# Altium project epsv2.PrjPCB
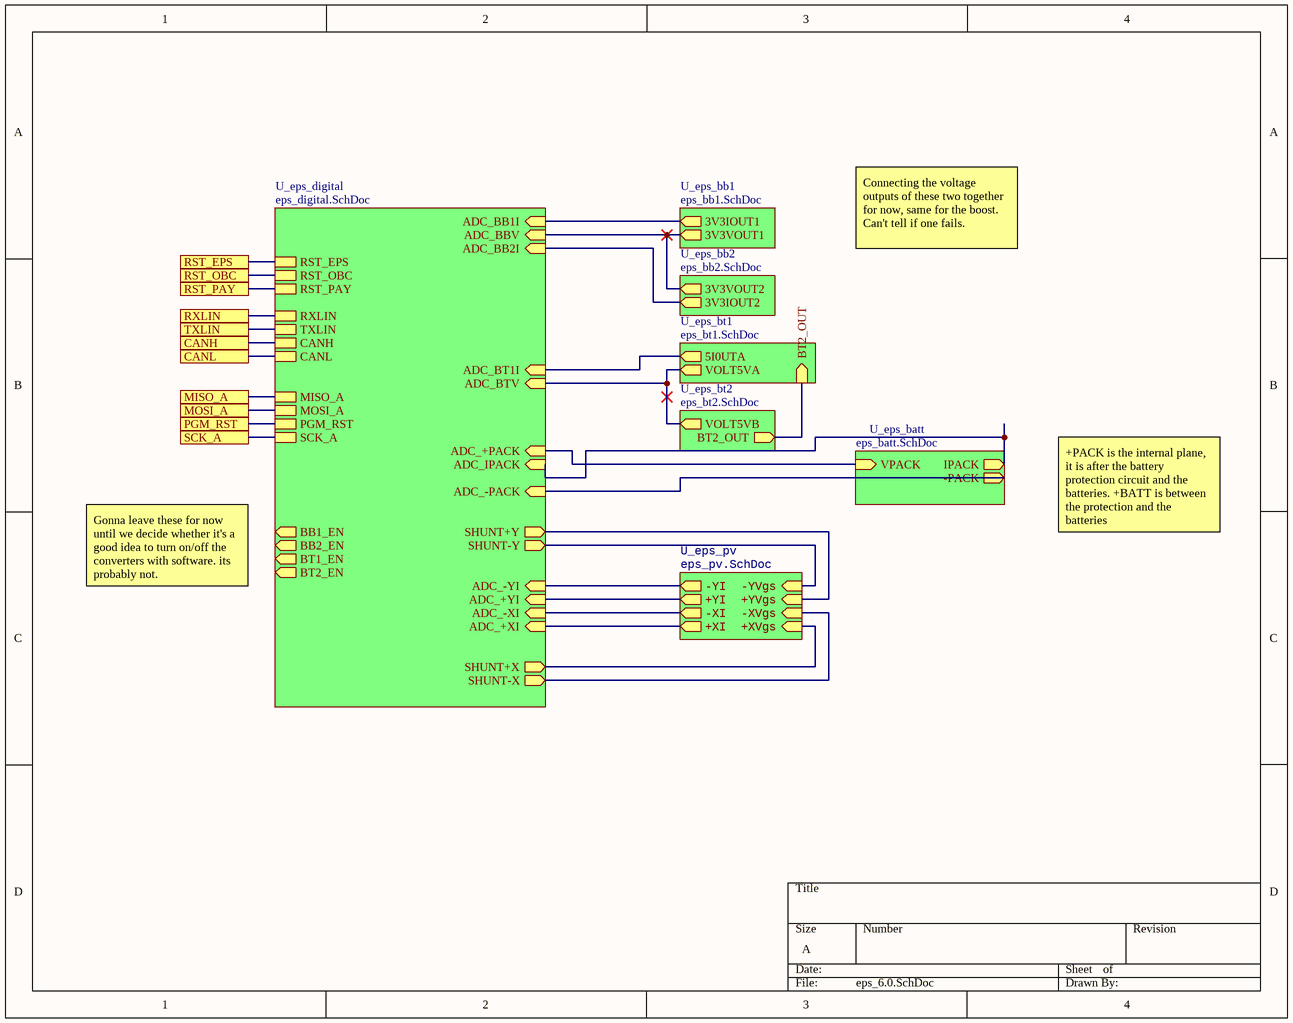
[diagram p0: eps_6.0.SchDoc]
10 sheets, 125 parts. Net scope: hierarchical (ports join the sheet entries above them; power ports are global).
Sheets:
  eps_6.0.SchDoc
    U_eps_digital = eps_digital.SchDoc
      U_eps_32m1 = eps_32m1.SchDoc
      U_eps_can_transceiver = eps_can_transceiver.SchDoc
      U_eps_pex = eps_pex.SchDoc
    U_eps_bb1 = eps_bb1.SchDoc
    U_eps_bb2 = eps_bb2.SchDoc
    U_eps_bt1 = eps_bt1.SchDoc
    U_eps_bt2 = eps_bt2.SchDoc
    U_eps_batt = eps_batt.SchDoc

## Sheet eps_6.0.SchDoc
size A

### Sub-sheets
U_eps_batt = eps_batt.SchDoc: IPACK (out), VPACK (in), -PACK (out)
U_eps_bb1 = eps_bb1.SchDoc: 3V3IOUT1 (out), 3V3VOUT1 (out)
U_eps_bb2 = eps_bb2.SchDoc: 3V3IOUT2 (out), 3V3VOUT2 (out)
U_eps_bt1 = eps_bt1.SchDoc: VOLT5VA (out), 5I0UTA (out), BT2_OUT (in)
U_eps_bt2 = eps_bt2.SchDoc: VOLT5VB (out), BT2_OUT (out)
U_eps_digital = eps_digital.SchDoc: RST_EPS, RST_OBC, RST_PAY, RXLIN, TXLIN, CANH, CANL, MISO_A, MOSI_A, PGM_RST, SCK_A, ADC_BTV (in), BT1_EN (out), BT2_EN (out), ADC_BT1I (in), ADC_-PACK (in), ADC_BB1I (in), ADC_BB2I (in), ADC_+XI (in), ADC_-XI (in), ADC_+YI (in), ADC_+PACK (in), ADC_-YI (in), SHUNT-Y (out), SHUNT+Y (out), BB2_EN (out), BB1_EN (out), ADC_BBV (in), SHUNT-X (out), SHUNT+X (out), ADC_IPACK (in)
U_eps_pv = eps_pv.SchDoc (file not in this document): +YI (out), -YI (out), -YVgs (in), +XI (out), +YVgs (in), +XVgs (in), -XVgs (in), -XI (out)

### Ports
CANH, CANL, MISO_A, MOSI_A, PGM_RST, RST_EPS, RST_OBC, RST_PAY, RXLIN, SCK_A, TXLIN

### Nets
-PACK: sheet U_eps_digital/ADC_-PACK, sheet U_eps_batt/-PACK
MISO_A: port MISO_A, sheet U_eps_digital/MISO_A
MOSI_A: port TXLIN, port MOSI_A, sheet U_eps_digital/TXLIN, sheet U_eps_digital/MOSI_A
RXLIN: port RXLIN, sheet U_eps_digital/RXLIN
Net1_1: sheet U_eps_bt1/BT2_OUT, sheet U_eps_bt2/BT2_OUT
Net5_1: sheet U_eps_digital/ADC_BTV, sheet U_eps_bt1/VOLT5VA, sheet U_eps_bt2/VOLT5VB
Net*5_6: sheet U_eps_digital/ADC_BB1I, sheet U_eps_bb1/3V3IOUT1
Net*6_6: sheet U_eps_digital/ADC_BB2I, sheet U_eps_bb2/3V3IOUT2
Net*30_6: sheet U_eps_digital/ADC_BT1I, sheet U_eps_bt1/5I0UTA
NetC28_2: sheet U_eps_digital/ADC_BBV, sheet U_eps_bb1/3V3VOUT1, sheet U_eps_bb2/3V3VOUT2
NetC45_2: sheet U_eps_digital/ADC_+PACK, sheet U_eps_batt/VPACK
NetP6_3: port SCK_A, sheet U_eps_digital/SCK_A
NetP6_5: port PGM_RST, sheet U_eps_digital/PGM_RST
NetR25_1: port RST_PAY, sheet U_eps_digital/RST_PAY
NetR26_1: port RST_OBC, sheet U_eps_digital/RST_OBC
NetR35_1: port CANL, sheet U_eps_digital/CANL
NetR38_1: port CANH, sheet U_eps_digital/CANH
NetS?_5: port RST_EPS, sheet U_eps_digital/RST_EPS
NetU3_21: sheet U_eps_digital/SHUNT+X, sheet U_eps_pv/+XVgs
NetU3_22: sheet U_eps_digital/SHUNT-X, sheet U_eps_pv/-XVgs
NetU3_23: sheet U_eps_digital/SHUNT+Y, sheet U_eps_pv/+YVgs
NetU3_24: sheet U_eps_digital/SHUNT-Y, sheet U_eps_pv/-YVgs
NetU11_6: sheet U_eps_digital/ADC_IPACK, sheet U_eps_batt/IPACK
(unnamed): sheet U_eps_digital/ADC_+XI, sheet U_eps_pv/+XI
(unnamed): sheet U_eps_digital/ADC_-XI, sheet U_eps_pv/-XI
(unnamed): sheet U_eps_digital/ADC_+YI, sheet U_eps_pv/+YI
(unnamed): sheet U_eps_digital/ADC_-YI, sheet U_eps_pv/-YI

### Notes on the sheet
- Connecting the voltage outputs of these two together for now, same for the boost. Can't tell if one fails.
- +PACK is the internal plane, it is after the battery protection circuit and the batteries. +BATT is between the protection and the batteries
- Gonna leave these for now until we decide whether it's a good idea to turn on/off the converters with software. its probably not.

## Sheet eps_digital.SchDoc
size A4
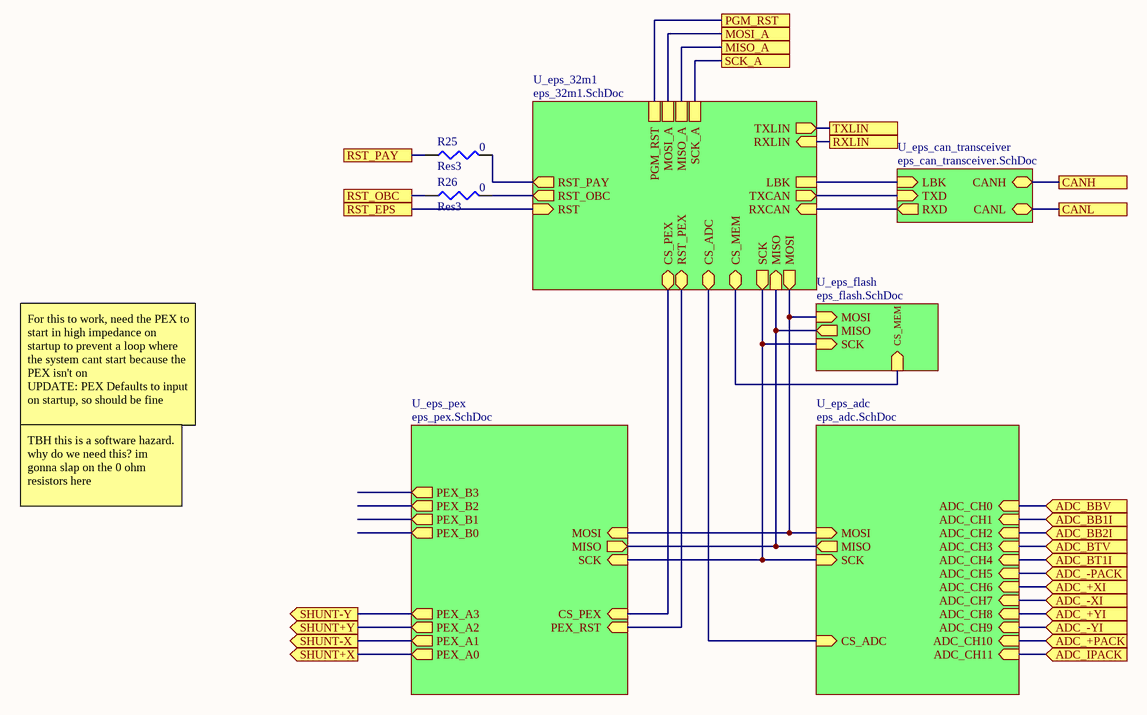
[diagram p1: eps_digital.SchDoc]

### Parts
R25  Res3  value 0  [J1-0603]
R26  Res3  value 0  [J1-0603]

### Sub-sheets
U_eps_32m1 = eps_32m1.SchDoc: MISO (in), SCK (out), TXLIN (out), MOSI (out), TXCAN (out), RXCAN (in), RXLIN (in), RST_OBC (out), RST_PAY (out), RST_PEX (bidir), CS_ADC (bidir), CS_PEX (bidir), CS_MEM (bidir), RST (in), LBK, PGM_RST, MOSI_A, MISO_A, SCK_A
U_eps_adc = eps_adc.SchDoc (file not in this document): ADC_CH10 (in), ADC_CH11 (in), ADC_CH9 (in), ADC_CH5 (in), ADC_CH6 (in), ADC_CH7 (in), ADC_CH3 (in), ADC_CH2 (in), ADC_CH8 (in), ADC_CH4 (in), ADC_CH1 (in), ADC_CH0 (in), MISO (out), MOSI (in), CS_ADC (in), SCK (in)
U_eps_can_transceiver = eps_can_transceiver.SchDoc: RXD (out), TXD (in), LBK (in), CANL (bidir), CANH (bidir)
U_eps_flash = eps_flash.SchDoc (file not in this document): SCK (in), CS_MEM (in), MOSI (in), MISO (out)
U_eps_pex = eps_pex.SchDoc: PEX_B0 (out), PEX_B1 (out), PEX_B2 (out), PEX_B3 (out), PEX_A1 (out), PEX_A2 (out), PEX_A0 (out), PEX_A3 (out), MISO (out), MOSI (in), SCK (in), CS_PEX (in), PEX_RST (in)

### Ports
ADC_+PACK (in), ADC_+XI (in), ADC_+YI (in), ADC_-PACK (in), ADC_-XI (in), ADC_-YI (in), ADC_BB1I (in), ADC_BB2I (in), ADC_BBV (in), ADC_BT1I (in), ADC_BTV (in), ADC_IPACK (in), CANH, CANL, MISO_A, MOSI_A, PGM_RST, RST_EPS, RST_OBC, RST_PAY, RXLIN, SCK_A, SHUNT+X (out), SHUNT+Y (out), SHUNT-X (out), SHUNT-Y (out), TXLIN

### Nets
-PACK: port ADC_-PACK, sheet U_eps_adc/ADC_CH5
MISO_A: port MISO_A, sheet U_eps_32m1/MISO_A
MOSI_A: port TXLIN, port MOSI_A, sheet U_eps_32m1/TXLIN, sheet U_eps_32m1/MOSI_A
RXLIN: port RXLIN, sheet U_eps_32m1/RXLIN
Net5_1: port ADC_BTV, sheet U_eps_adc/ADC_CH3
Net*5_6: port ADC_BB1I, sheet U_eps_adc/ADC_CH1
Net*6_6: port ADC_BB2I, sheet U_eps_adc/ADC_CH2
Net*30_6: port ADC_BT1I, sheet U_eps_adc/ADC_CH4
NetC28_2: port ADC_BBV, sheet U_eps_adc/ADC_CH0
NetC45_2: port ADC_+PACK, sheet U_eps_adc/ADC_CH10
NetP6_3: port SCK_A, sheet U_eps_32m1/SCK_A
NetP6_5: port PGM_RST, sheet U_eps_32m1/PGM_RST
NetR10_2: sheet U_eps_32m1/RST_PEX, sheet U_eps_pex/PEX_RST
NetR25_1: R25.1 ; port RST_PAY
NetR25_2: R25.2 ; sheet U_eps_32m1/RST_PAY
NetR26_1: R26.1 ; port RST_OBC
NetR26_2: R26.2 ; sheet U_eps_32m1/RST_OBC
NetR34_2: sheet U_eps_32m1/RXCAN, sheet U_eps_can_transceiver/RXD
NetR35_1: port CANL, sheet U_eps_can_transceiver/CANL
NetR36_2: sheet U_eps_32m1/TXCAN, sheet U_eps_can_transceiver/TXD
NetR37_2: sheet U_eps_32m1/LBK, sheet U_eps_can_transceiver/LBK
NetR38_1: port CANH, sheet U_eps_can_transceiver/CANH
NetS?_5: port RST_EPS, sheet U_eps_32m1/RST
NetU3_11: sheet U_eps_32m1/CS_PEX, sheet U_eps_pex/CS_PEX
NetU3_12: sheet U_eps_32m1/SCK, sheet U_eps_flash/SCK, sheet U_eps_pex/SCK, sheet U_eps_adc/SCK
NetU3_13: sheet U_eps_32m1/MOSI, sheet U_eps_flash/MOSI, sheet U_eps_pex/MOSI, sheet U_eps_adc/MOSI
NetU3_14: sheet U_eps_32m1/MISO, sheet U_eps_flash/MISO, sheet U_eps_pex/MISO, sheet U_eps_adc/MISO
NetU3_21: port SHUNT+X, sheet U_eps_pex/PEX_A0
NetU3_22: port SHUNT-X, sheet U_eps_pex/PEX_A1
NetU3_23: port SHUNT+Y, sheet U_eps_pex/PEX_A2
NetU3_24: port SHUNT-Y, sheet U_eps_pex/PEX_A3
NetU4_16: sheet U_eps_32m1/CS_MEM, sheet U_eps_flash/CS_MEM
NetU4_23: sheet U_eps_32m1/CS_ADC, sheet U_eps_adc/CS_ADC
NetU11_6: port ADC_IPACK, sheet U_eps_adc/ADC_CH11
(unnamed): port ADC_+XI, sheet U_eps_adc/ADC_CH6
(unnamed): port ADC_-XI, sheet U_eps_adc/ADC_CH7
(unnamed): port ADC_+YI, sheet U_eps_adc/ADC_CH8
(unnamed): port ADC_-YI, sheet U_eps_adc/ADC_CH9

### Notes on the sheet
- For this to work, need the PEX to start in high impedance on startup to prevent a loop where the system cant start because the PEX isn't on
  UPDATE: PEX Defaults to input on startup, so should be fine
- TBH this is a software hazard. why do we need this? im gonna slap on the 0 ohm resistors here

### Library data of the parts
R25 R26 = Res3: Resistor; Published: 8-Jun-2000; LatestRevisionDate: 29-May-2009; LatestRevisionNote: IPC-7351 Footprint Added.; PackageReference: J1-0603; Publisher: Altium Limited; PackageDescription: Chip Resistor

## Sheet eps_32m1.SchDoc
size A4
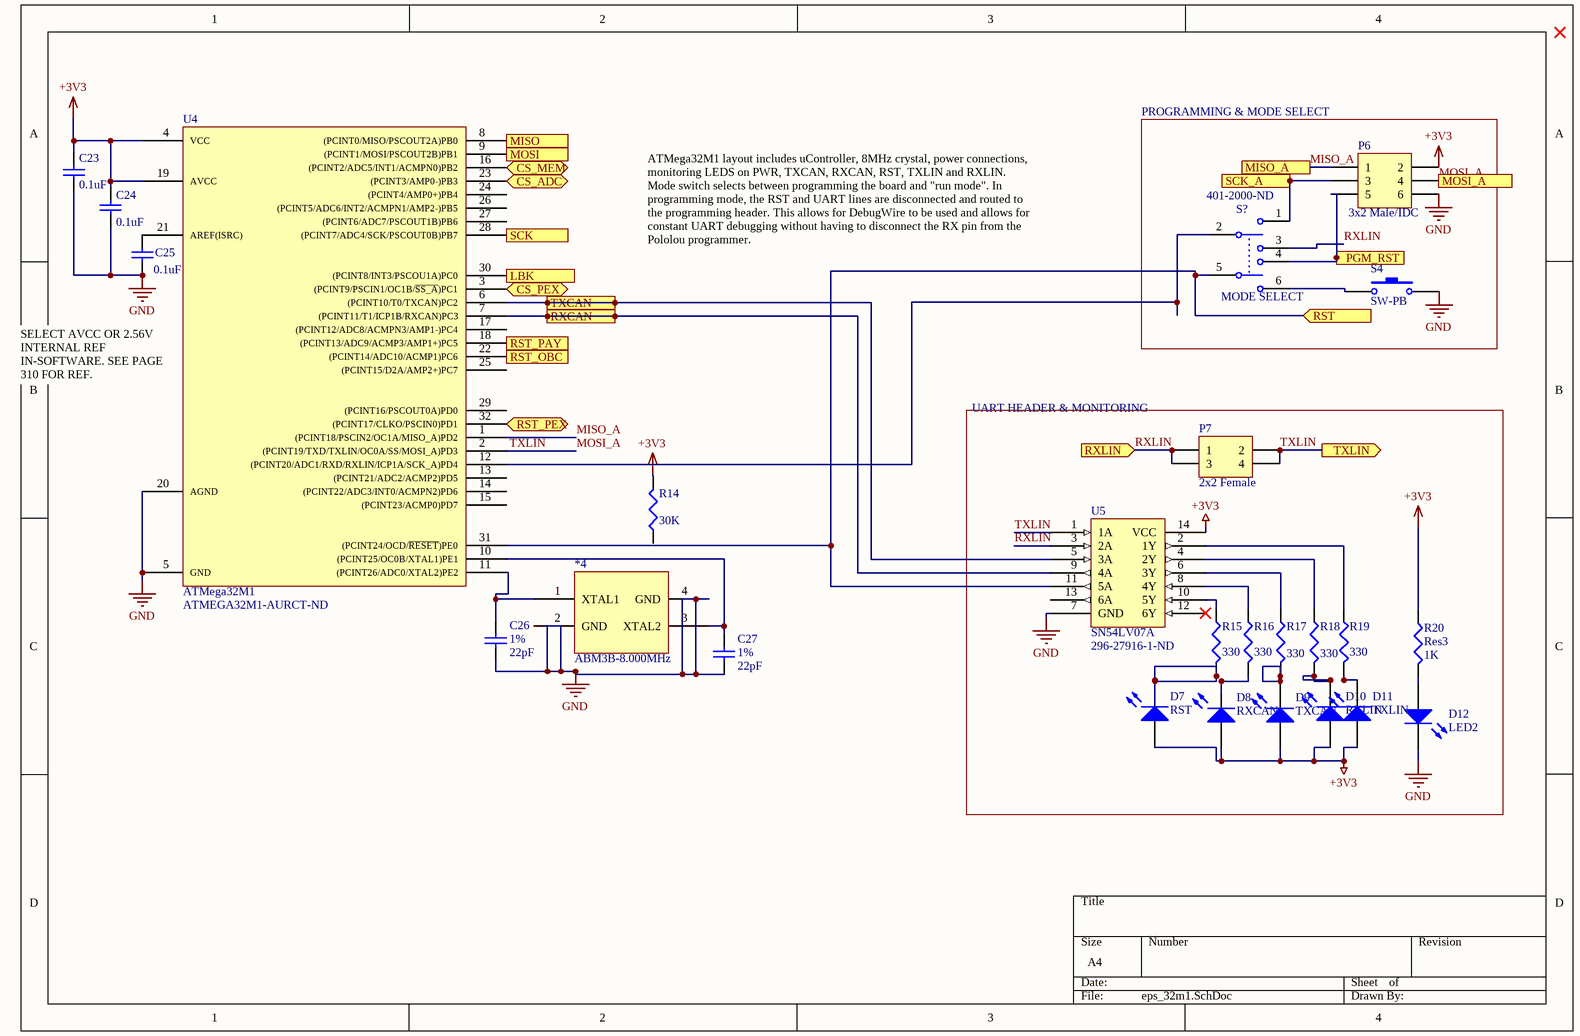
[diagram p2: eps_32m1.SchDoc]

### Parts
*4  ABM3B-8.000MHz  [OSCSC500X320X110-4N]
C23  value 0.1uF  [1608[0603]]  (hidden comment: Cap Semi)
C24  value 0.1uF  [1608[0603]]  (hidden comment: Cap Semi)
C25  value 0.1uF  [1608[0603]]  (hidden comment: Cap Semi)
C26  1%  value 22pF  [1608[0603]]
C27  1%  value 22pF  [1608[0603]]
D7  RST  [1608[0603]]
D8  RXCAN  [1608[0603]]
D9  TXCAN  [1608[0603]]
D10  RXLIN  [1608[0603]]
D11  TXLIN  [1608[0603]]
D12  LED2  [1608[0603]]
P6  3x2 Male/IDC  [HDR2X3]
P7  2x2 Female  [HDR2X2]
R14  value 30K  [J1-0603]
R15  value 330  [J1-0603]  (hidden comment: Res3)
R16  value 330  [J1-0603]  (hidden comment: Res3)
R17  value 330  [J1-0603]  (hidden comment: Res3)
R18  value 330  [J1-0603]  (hidden comment: Res3)
R19  value 330  [J1-0603]  (hidden comment: Res3)
R20  Res3  value 1K  [J1-0603]
S4  SW-PB  [SW415-ND]
S?  MODE SELECT  Supplier Part Number: 401-2000-ND  [DPST_32m1_switch]
U4  ATMega32M1  Supplier Part Number 1: ATMEGA32M1-AURCT-ND  [QFP80P900X900X120-32N]
U5  SN54LV07A  Supplier Part Number: 296-27916-1-ND  [SOP65P640X120-14N]

### Blocks framed on the sheet
PROGRAMMING & MODE SELECT: P6 S4 S?
UART HEADER & MONITORING: D7-D12 P7 R15-R20 U5

### Ports
CS_ADC (bidir), CS_MEM (bidir), CS_PEX (bidir), LBK, MISO (in), MISO_A, MOSI (out), MOSI_A, PGM_RST, RST (in), RST_OBC (out), RST_PAY (out), RST_PEX (bidir), RXCAN, RXLIN (in), SCK (out), SCK_A, TXCAN, TXLIN (out)

### Nets
+3V3: C23.2 C24.2 D7.1(A) D8.1(A) D9.1(A) D10.1(A) D11.1(A) P6.2 R14.2 R20.1 U4.4(VCC) U4.19(AVCC) U5.14(VCC)
GND: *4.4(GND) C23.1 C24.1 C25.2 C26.1 C27.1 D12.2(K) P6.6 S4.2 U4.5(GND) U4.20(AGND) U5.7(GND)
MISO_A: P6.1 U4.1((PCINT18/PSCIN2/OC1A/MISO_A)PD2) ; port MISO_A
MOSI_A: P6.4 P7.2 P7.4 U4.2((PCINT19/TXD/TXLIN/OC0A/SS/MOSI_A)PD3) U5.1(1A) ; port TXLIN, port MOSI_A  [also labelled TXLIN]
RXLIN: P7.1 P7.3 S?.3 U5.3(2A) ; port RXLIN
Net*4_1: *4.1(XTAL1) C26.2 U4.11((PCINT26/ADC0/XTAL2)PE2)
Net*4_3: *4.3(XTAL2) C27.2 U4.10((PCINT25/OC0B/XTAL1)PE1)
NetC25_1: C25.1 U4.21(AREF(ISRC))
NetD7_2: D7.2(K) R15.2
NetD8_2: D8.2(K) R16.2
NetD9_2: D9.2(K) R17.2
NetD10_2: D10.2(K) R18.2
NetD11_2: D11.2(K) R19.2
NetD12_1: D12.1(A) R20.2
NetP6_3: P6.3 S?.1 ; port SCK_A
NetP6_5: P6.5 S?.4 ; port PGM_RST
NetR10_2: U4.32((PCINT17/CLKO/PSCIN0)PD1) ; port RST_PEX
NetR15_1: R15.1 U5.10(5Y)
NetR16_1: R16.1 U5.8(4Y)
NetR17_1: R17.1 U5.6(3Y)
NetR18_1: R18.1 U5.4(2Y)
NetR19_1: R19.1 U5.2(1Y)
NetR25_2: U4.18((PCINT13/ADC9/ACMP3/AMP1+)PC5) ; port RST_PAY
NetR26_2: U4.22((PCINT14/ADC10/ACMP1)PC6) ; port RST_OBC
NetR34_2: U4.7((PCINT11/T1/ICP1B/RXCAN)PC3) U5.9(4A) ; port RXCAN
NetR36_2: U4.6((PCINT10/T0/TXCAN)PC2) U5.5(3A) ; port TXCAN
NetR37_2: U4.30((PCINT8/INT3/PSCOU1A)PC0) ; port LBK
NetS4_1: S4.1 S?.6
NetS?_2: S?.2 U4.12((PCINT20/ADC1/RXD/RXLIN/ICP1A/SCK_A)PD4)
NetS?_5: S?.5 U4.31((PCINT24/OCD/~{RESET})PE0) U5.11(5A) ; port RST
NetU3_11: U4.3((PCINT9/PSCIN1/OC1B/~{SS_A})PC1) ; port CS_PEX
NetU3_12: U4.28((PCINT7/ADC4/SCK/PSCOUT0B)PB7) ; port SCK
NetU3_13: U4.9((PCINT1/MOSI/PSCOUT2B)PB1) ; port MOSI
NetU3_14: U4.8((PCINT0/MISO/PSCOUT2A)PB0) ; port MISO
NetU4_16: U4.16((PCINT2/ADC5/INT1/ACMPN0)PB2) ; port CS_MEM
NetU4_23: U4.23((PCINT3/AMP0-)PB3) ; port CS_ADC

Not connected (* = marked no-connect by the designer): *4 2(GND); R14 1; U4 13((PCINT21/ADC2/ACMP2)PD5) 14((PCINT22/ADC3/INT0/ACMPN2)PD6) 15((PCINT23/ACMP0)PD7) 17((PCINT12/ADC8/ACMPN3/AMP1-)PC4) 24((PCINT4/AMP0+)PB4) 25((PCINT15/D2A/AMP2+)PC7) 26((PCINT5/ADC6/INT2/ACMPN1/AMP2-)PB5) 27((PCINT6/ADC7/PSCOUT1B)PB6) 29((PCINT16/PSCOUT0A)PD0); U5 12(6Y)* 13(6A)

### Notes on the sheet
- ATMega32M1 layout includes uController, 8MHz crystal, power connections, monitoring LEDS on PWR, TXCAN, RXCAN, RST, TXLIN and RXLIN. Mode switch selects between programming the board and "run mode". In programming mode, the RST and UART lines are disconnected and routed to the programming header. This allows for DebugWire to be used and allows for constant UART debugging without having to disconnect the RX pin from the Pololou programmer.
- (near U4) SELECT AVCC OR 2.56V INTERNAL REF IN-SOFTWARE. SEE PAGE 310 FOR REF.

### Library data of the parts
C23-C27 = Cap Semi: Capacitor (Semiconductor SIM Model); Published: 8-Jun-2000; LatestRevisionDate: 29-May-2009; LatestRevisionNote: IPC-7351 Footprint Added.; PackageReference: C1206; Publisher: Altium Limited; PackageDescription: Chip Capacitor
D7-D12 = LED2: Typical RED, GREEN, YELLOW, AMBER GaAs LED; Published: 8-Jun-2000; LatestRevisionDate: 17-Jul-2002; LatestRevisionNote: Re-released for DXP Platform.; PackageVersion: Feb-2002; PackageReference: 3.2X1.6X1.1; Publisher: Altium Limited; PackageDescription: SM LED; 2 Flat Leads
P6 = Header 3X2: 2x3 through-hole programming header, IDC; LatestRevisionDate: 17-Jul-2002; LatestRevisionNote: Re-released for DXP Platform.; Publisher: Altium Limited
P7 = Header 2X2: Header, 2-Pin, Dual row; LatestRevisionDate: 17-Jul-2002; LatestRevisionNote: Re-released for DXP Platform.; Publisher: Altium Limited
R14 = Res3: 30K Pull-up resistor for RST. See page; Published: 8-Jun-2000; LatestRevisionDate: 29-May-2009; LatestRevisionNote: IPC-7351 Footprint Added.; PackageReference: J1-0603; Publisher: Altium Limited; PackageDescription: Chip Resistor
R15-R20 = Res3: Resistor; Published: 8-Jun-2000; LatestRevisionDate: 29-May-2009; LatestRevisionNote: IPC-7351 Footprint Added.; PackageReference: J1-0603; Publisher: Altium Limited; PackageDescription: Chip Resistor
S4 = SW-PB: Switch; Published: 24-Mar-1999; LatestRevisionDate: 17-Jul-2002; LatestRevisionNote: Re-released for DXP Platform.; PackageReference: SPST-2; Publisher: Altium Limited; PackageDescription: Switch; 2 Leads
S? = SW-DPDT: Double-Pole, Double-Throw Switch; Published: 24-Mar-1999; LatestRevisionDate: 17-Jul-2002; LatestRevisionNote: Re-released for DXP Platform.; PackageReference: DPDT-6; Publisher: Altium Limited; PackageDescription: Switch; 6 Leads; Supplier: Digi-Key
U4 = ATMega32M1: Atmel 8-bit AVR microcontroller.; Supplier 1: Digi-Key
U5 = SN54LV07A: Six element 1-bit non-inverting open-drain buffer.; Supplier: Digi-Key

## Sheet eps_can_transceiver.SchDoc
size A4
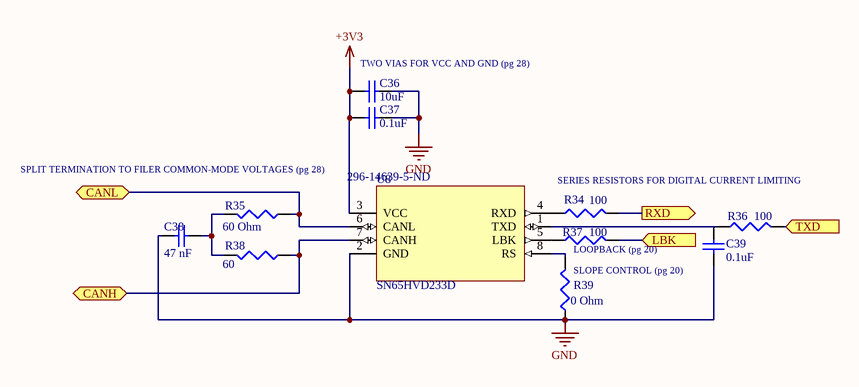
[diagram p3: eps_can_transceiver.SchDoc]

### Parts
C36  value 10uF  [1608[0603]]  (hidden comment: Cap Semi)
C37  value 0.1uF  [1608[0603]]  (hidden comment: Cap Semi)
C38  value 47 nF  [1608[0603]]  (hidden comment: Ceramic)
C39  0.1uF  [1608[0603]]
R34  value 100  [J1-0603]
R35  value 60 Ohm  [J1-0603]  (hidden comment: 0603)
R36  value 100  [J1-0603]
R37  100  [J1-0603]
R38  value 60  [J1-0603]  (hidden comment: 0603)
R39  value 0 Ohm  [J1-0603]
U8  SN65HVD233D  Supplier Part Number 1: 296-14639-5-ND  [SOIC127P500X600-8N]

### Ports
CANH (bidir), CANL (bidir), LBK (in), RXD (out), TXD (in)

### Nets
+3V3: C36.2 C37.2 U8.3(VCC)
GND: C36.1 C37.1 C38.1 C39.1 R39.1 U8.2(GND)
NetC38_2: C38.2 R35.2 R38.2
NetC39_2: C39.2 R36.1 U8.1(TXD)
NetR34_1: R34.1 U8.4(RXD)
NetR34_2: R34.2 ; port RXD
NetR35_1: R35.1 U8.6(CANL) ; port CANL
NetR36_2: R36.2 ; port TXD
NetR37_1: R37.1 U8.5(LBK)
NetR37_2: R37.2 ; port LBK
NetR38_1: R38.1 U8.7(CANH) ; port CANH
NetR39_2: R39.2 U8.8(RS)

### Notes on the sheet
- (near C36) TWO VIAS FOR VCC AND GND (pg 28)
- SPLIT TERMINATION TO FILER COMMON-MODE VOLTAGES (pg 28)
- SERIES RESISTORS FOR DIGITAL CURRENT LIMITING
- (near R39) SLOPE CONTROL (pg 20)
- (near R37) LOOPBACK (pg 20)

### Library data of the parts
C36-C39 = Cap Semi: Capacitor (Semiconductor SIM Model); Published: 8-Jun-2000; LatestRevisionDate: 29-May-2009; LatestRevisionNote: IPC-7351 Footprint Added.; PackageReference: C1206; Publisher: Altium Limited; PackageDescription: Chip Capacitor
  C39: Value: 0.1uF
R34-R39 = Res3: Resistor; Published: 8-Jun-2000; LatestRevisionDate: 29-May-2009; LatestRevisionNote: IPC-7351 Footprint Added.; PackageReference: J1-0603; Publisher: Altium Limited; PackageDescription: Chip Resistor
  R37: Value: 100
U8 = SN65HVD233D: 3.3V CAN Transceiver with Standby Mode, Loop-back 8-SOIC -40 to 125; MF: Texas Instruments; MP: SN65HVD233D; Package: SOIC-8 Texas Instruments; Availability: Good; SnapEDA_Link: https://www.snapeda.com/parts/SN65HVD233D/Texas%20Instruments/view-part/?ref=snap; Price: 2.39 USD; Value: *; Supplier 1: Digi-Key

## Sheet eps_pex.SchDoc
size A4
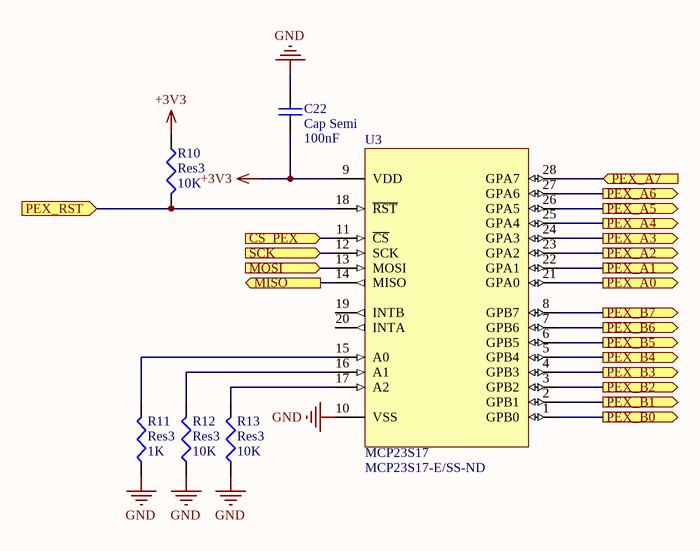
[diagram p4: eps_pex.SchDoc]

### Parts
C22  Cap Semi  value 100nF  [1608[0603]]
R10  Res3  value 10K  [J1-0603]
R11  Res3  value 1K  [J1-0603]
R12  Res3  value 10K  [J1-0603]
R13  Res3  value 10K  [J1-0603]
U3  MCP23S17  Supplier Part Number 1: MCP23S17-E/SS-ND  [SOP65P780X200-28N]

### Ports
CS_PEX (in), MISO (out), MOSI (in), PEX_A0 (out), PEX_A1 (out), PEX_A2 (out), PEX_A3 (out), PEX_A4 (out), PEX_A5 (out), PEX_A6 (out), PEX_A7 (in), PEX_B0 (out), PEX_B1 (out), PEX_B2 (out), PEX_B3 (out), PEX_B4 (out), PEX_B5 (out), PEX_B6 (out), PEX_B7 (out), PEX_RST (in), SCK (in)

### Nets
+3V3: C22.2 R10.1 U3.9(VDD)
GND: C22.1 R11.1 R12.1 R13.1 U3.10(VSS)
NetR10_2: R10.2 U3.18(~{RST}) ; port PEX_RST
NetR11_2: R11.2 U3.15(A0)
NetR12_2: R12.2 U3.16(A1)
NetR13_2: R13.2 U3.17(A2)
NetU3_1: U3.1(GPB0) ; port PEX_B0
NetU3_2: U3.2(GPB1) ; port PEX_B1
NetU3_3: U3.3(GPB2) ; port PEX_B2
NetU3_4: U3.4(GPB3) ; port PEX_B3
NetU3_5: U3.5(GPB4) ; port PEX_B4
NetU3_6: U3.6(GPB5) ; port PEX_B5
NetU3_7: U3.7(GPB6) ; port PEX_B6
NetU3_8: U3.8(GPB7) ; port PEX_B7
NetU3_11: U3.11(~{CS}) ; port CS_PEX
NetU3_12: U3.12(SCK) ; port SCK
NetU3_13: U3.13(MOSI) ; port MOSI
NetU3_14: U3.14(MISO) ; port MISO
NetU3_21: U3.21(GPA0) ; port PEX_A0
NetU3_22: U3.22(GPA1) ; port PEX_A1
NetU3_23: U3.23(GPA2) ; port PEX_A2
NetU3_24: U3.24(GPA3) ; port PEX_A3
NetU3_25: U3.25(GPA4) ; port PEX_A4
NetU3_26: U3.26(GPA5) ; port PEX_A5
NetU3_27: U3.27(GPA6) ; port PEX_A6
NetU3_28: U3.28(GPA7) ; port PEX_A7

Not connected (* = marked no-connect by the designer): U3 19(INTB) 20(INTA)

### Library data of the parts
C22 = Cap Semi: Capacitor (Semiconductor SIM Model); Published: 8-Jun-2000; LatestRevisionDate: 29-May-2009; LatestRevisionNote: IPC-7351 Footprint Added.; PackageReference: C1206; Publisher: Altium Limited; PackageDescription: Chip Capacitor
R10-R13 = Res3: Resistor; Published: 8-Jun-2000; LatestRevisionDate: 29-May-2009; LatestRevisionNote: IPC-7351 Footprint Added.; PackageReference: J1-0603; Publisher: Altium Limited; PackageDescription: Chip Resistor
U3 = MCP23S17: 16 bit I/O expander with SPI interface.; Supplier 1: Digi-Key

## Sheet eps_bb1.SchDoc
size A4
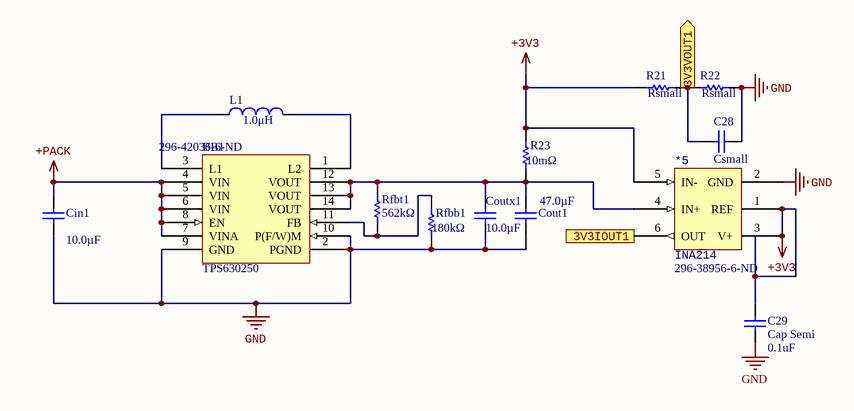
[diagram p5: eps_bb1.SchDoc]

### Parts
*5  INA214  Supplier Part Number 1: 296-38956-6-ND  [SOT65P210X110-6N]
BB1  TPS630250  Supplier Part Number 1: 296-42036-6-ND  [RNC0014A]
C28  value Csmall  [1608[0603]]  (hidden comment: Cap)
C29  Cap Semi  value 0.1uF  [1608[0603]]
Cin1  value 10.0µF  [1608[0603]]  (hidden comment: Cap)
Cout1  value 47.0µF  [1608[0603]]  (hidden comment: Cap)
Coutx1  value 10.0µF  [1608[0603]]  (hidden comment: Cap)
L1  value 1.0μH  [1608[0603]]  (hidden comment: Inductor)
R21  value Rsmall  [1608[0603]]  (hidden comment: Res1)
R22  value Rsmall  [1608[0603]]  (hidden comment: Res1)
R23  value 10mΩ  [1608[0603]]  (hidden comment: Res1)
Rfbb1  value 180kΩ  [1608[0603]]  (hidden comment: Res1)
Rfbt1  value 562kΩ  [1608[0603]]  (hidden comment: Rfbt1)

### Ports
3V3IOUT1 (out), 3V3VOUT1 (out)

### Nets
+3V3: *5.1(REF) *5.3(V+) *5.5(IN-) C29.2 R21.1 R23.2
+PACK: BB1.4(VIN) BB1.5(VIN) BB1.6(VIN) BB1.7(VINA) BB1.8(EN) Cin1.2
GND: *5.2(GND) BB1.2(PGND) BB1.9(GND) BB1.10(P(F/W)M) C28.1 C29.1 Cin1.1 Cout1.1 Coutx1.1 R22.2 Rfbb1.1
Net*5_4: *5.4(IN+) BB1.12(VOUT) BB1.13(VOUT) BB1.14(VOUT) Cout1.2 Coutx1.2 R23.1 Rfbt1.1
Net*5_6: *5.6(OUT) ; port 3V3IOUT1
NetBB1_1: BB1.1(L2) L1.2
NetBB1_3: BB1.3(L1) L1.1
NetBB1_11: BB1.11(FB) Rfbb1.2 Rfbt1.2
NetC28_2: C28.2 R21.2 R22.1 ; port 3V3VOUT1

### Library data of the parts
*5 = INA214: Current monitor; Supplier 1: Digi-Key
BB1 = TPS630250: Buck-boost converter; Supplier 1: Digi-Key
C28 Cin1 Cout1 Coutx1 = Cap: Capacitor; Published: 8-Jun-2000; LatestRevisionDate: 17-Jul-2002; LatestRevisionNote: Re-released for DXP Platform.; PackageReference: RAD-0.3; Publisher: Altium Limited; PackageDescription: Radial Cap, Thru-Hole; 2 Leads; 0.3 in Pin Spacing
C29 = Cap Semi: Capacitor (Semiconductor SIM Model); Published: 8-Jun-2000; LatestRevisionDate: 29-May-2009; LatestRevisionNote: IPC-7351 Footprint Added.; PackageReference: C1206; Publisher: Altium Limited; PackageDescription: Chip Capacitor
L1 = Inductor: Code_IEC: 1005; Published: 8-Jun-2000; LatestRevisionDate: 29-May-2009; LatestRevisionNote: IPC-7351 Footprint Added.; PackageReference: 0402-A; Publisher: Altium Limited; PackageDescription: Chip Inductor; Code_JEITA: 0402
R21-R23 Rfbb1 Rfbt1 = Res1: Resistor; Published: 8-Jun-2000; LatestRevisionDate: 17-Jul-2002; LatestRevisionNote: Re-released for DXP Platform.; PackageReference: AXIAL-0.3; Publisher: Altium Limited; PackageDescription: Axial Device, Thru-Hole; 2 Leads; 0.3 in Pin Spacing

## Sheet eps_bb2.SchDoc
size A4
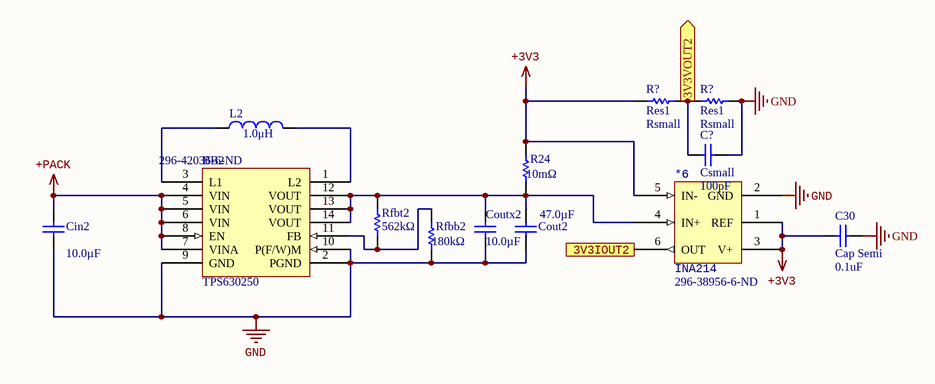
[diagram p6: eps_bb2.SchDoc]

### Parts
(Parts that share a designator on the sheet are numbered #1, #2 ... from top to bottom, then left to right.)
*6  INA214  Supplier Part Number 1: 296-38956-6-ND  [SOT65P210X110-6N]
BB2  TPS630250  Supplier Part Number 1: 296-42036-6-ND  [RNC0014A]
C30  Cap Semi  value 0.1uF  [1608[0603]]
C?  Csmall  value 100pF  [RAD-0.3]
Cin2  value 10.0µF  [1608[0603]]  (hidden comment: Cap)
Cout2  value 47.0µF  [1608[0603]]  (hidden comment: Cap)
Coutx2  value 10.0µF  [1608[0603]]  (hidden comment: Cap)
L2  value 1.0μH  [1608[0603]]  (hidden comment: Inductor)
R24  value 10mΩ  [1608[0603]]  (hidden comment: Res1)
R?#1  Res1  value Rsmall  [AXIAL-0.3]
R?#2  Res1  value Rsmall  [AXIAL-0.3]
Rfbb2  value 180kΩ  [1608[0603]]  (hidden comment: Res1)
Rfbt2  value 562kΩ  [1608[0603]]  (hidden comment: Rfbt1)

### Ports
3V3IOUT2 (out), 3V3VOUT2 (out)

### Nets
+3V3: *6.1(REF) *6.3(V+) *6.5(IN-) C30.2 R24.2 R?#1.1
+PACK: BB2.4(VIN) BB2.5(VIN) BB2.6(VIN) BB2.7(VINA) BB2.8(EN) Cin2.2
GND: *6.2(GND) BB2.2(PGND) BB2.9(GND) BB2.10(P(F/W)M) C30.1 C?.2 Cin2.1 Cout2.1 Coutx2.1 R?#2.2 Rfbb2.1
Net*6_4: *6.4(IN+) BB2.12(VOUT) BB2.13(VOUT) BB2.14(VOUT) Cout2.2 Coutx2.2 R24.1 Rfbt2.1
Net*6_6: *6.6(OUT) ; port 3V3IOUT2
NetBB2_1: BB2.1(L2) L2.2
NetBB2_3: BB2.3(L1) L2.1
NetBB2_11: BB2.11(FB) Rfbb2.2 Rfbt2.2
NetC28_2: C?.1 R?#1.2 R?#2.1 ; port 3V3VOUT2

### Library data of the parts
*6 = INA214: Current monitor; Supplier 1: Digi-Key
BB2 = TPS630250: Buck-boost converter; Supplier 1: Digi-Key
C30 = Cap Semi: Capacitor (Semiconductor SIM Model); Published: 8-Jun-2000; LatestRevisionDate: 29-May-2009; LatestRevisionNote: IPC-7351 Footprint Added.; PackageReference: C1206; Publisher: Altium Limited; PackageDescription: Chip Capacitor
C? Cin2 Cout2 Coutx2 = Cap: Capacitor; Published: 8-Jun-2000; LatestRevisionDate: 17-Jul-2002; LatestRevisionNote: Re-released for DXP Platform.; PackageReference: RAD-0.3; Publisher: Altium Limited; PackageDescription: Radial Cap, Thru-Hole; 2 Leads; 0.3 in Pin Spacing
L2 = Inductor: Code_IEC: 1005; Published: 8-Jun-2000; LatestRevisionDate: 29-May-2009; LatestRevisionNote: IPC-7351 Footprint Added.; PackageReference: 0402-A; Publisher: Altium Limited; PackageDescription: Chip Inductor; Code_JEITA: 0402
R24 R?#1 R?#2 Rfbb2 Rfbt2 = Res1: Resistor; Published: 8-Jun-2000; LatestRevisionDate: 17-Jul-2002; LatestRevisionNote: Re-released for DXP Platform.; PackageReference: AXIAL-0.3; Publisher: Altium Limited; PackageDescription: Axial Device, Thru-Hole; 2 Leads; 0.3 in Pin Spacing

## Sheet eps_bt1.SchDoc
size A
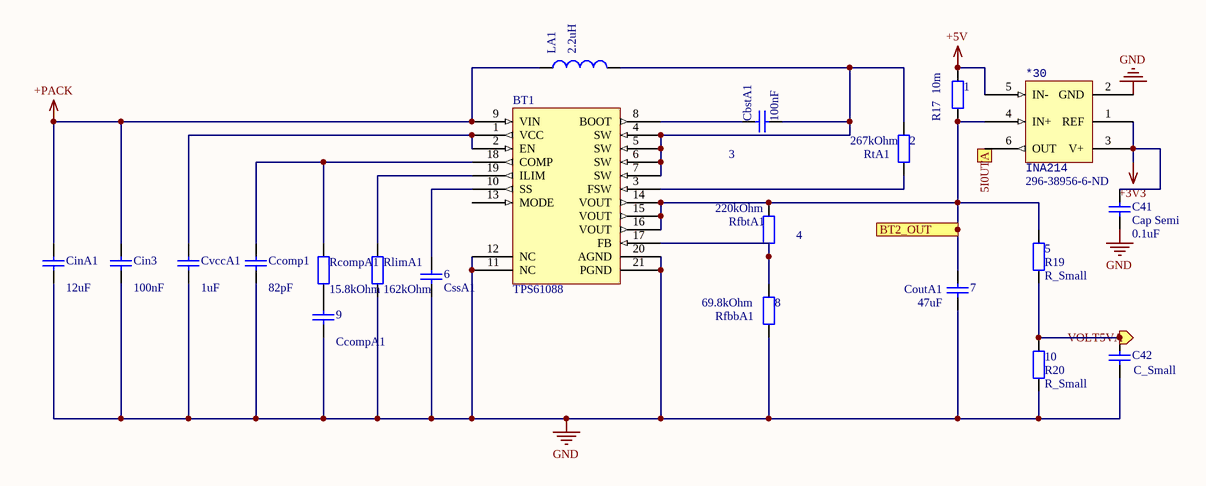
[diagram p7: eps_bt1.SchDoc]

### Parts
1  R17  value 10m  [1608[0603]]
2  RtA1  value 267kOhm  [1608[0603]]
3  CbstA1  value 100nF  [1608[0603]]
4  RfbtA1  value 220kOhm  [1608[0603]]
5  R19  value R_Small  [1608[0603]]
6  CssA1  [1608[0603]]
7  CoutA1  value 47uF  [1608[0603]]
8  RfbbA1  value 69.8kOhm  [1608[0603]]
9  value CcompA1  [1608[0603]]
10  R20  value R_Small  [1608[0603]]
*30  INA214  Supplier Part Number 1: 296-38956-6-ND  [SOT65P210X110-6N]
BT1  TPS61088  [QFN50P450X350X100-21N]
C41  Cap Semi  value 0.1uF  [1608[0603]]
C42  value C_Small  [1608[0603]]
Ccomp1  value 82pF  [1608[0603]]
Cin3  value 100nF  [1608[0603]]
CinA1  value 12uF  [1608[0603]]
CvccA1  value 1uF  [1608[0603]]
LA1  value 2.2uH  [1608[0603]]
RcompA1  value 15.8kOhm  [1608[0603]]
RlimA1  value 162kOhm  [1608[0603]]

### Ports
5I0UTA (out), BT2_OUT (in), VOLT5VA (out)

### Nets
+3V3: *30.1(REF) *30.3(V+) C41.2
+5V: 1.2 *30.5(IN-)
+PACK: BT1.9(VIN) Cin3.2 CinA1.2 LA1.1
GND: 6.1 7.1 8.1 9.1 10.1 *30.2(GND) BT1.11(NC) BT1.12(NC) BT1.20(AGND) BT1.21(PGND) C41.1 C42.2 Ccomp1.1 Cin3.1 CinA1.1 CvccA1.1 RlimA1.1
Net1_1: 1.1 4.2 5.2 7.2 *30.4(IN+) BT1.14(VOUT) BT1.15(VOUT) BT1.16(VOUT) ; port BT2_OUT
Net2_1: 2.1 3.1 BT1.4(SW) BT1.5(SW) BT1.6(SW) BT1.7(SW) LA1.2
Net2_2: 2.2 BT1.3(FSW)
Net3_2: 3.2 BT1.8(BOOT)
Net4_1: 4.1 8.2 BT1.17(FB)
Net5_1: 5.1 10.2 C42.1 ; port VOLT5VA
Net6_2: 6.2 BT1.10(SS)
Net9_2: 9.2 RcompA1.1
Net*30_6: *30.6(OUT) ; port 5I0UTA
NetBT1_1: BT1.1(VCC) BT1.2(EN) CvccA1.2
NetBT1_18: BT1.18(COMP) Ccomp1.2 RcompA1.2
NetBT1_19: BT1.19(ILIM) RlimA1.2

Not connected (* = marked no-connect by the designer): BT1 13(MODE)

### Library data of the parts
1 2 4 5 8 10 RcompA1 RlimA1 = Res2: Resistor; Published: 8-Jun-2000; LatestRevisionDate: 17-Jul-2002; LatestRevisionNote: Re-released for DXP Platform.; PackageReference: AXIAL-0.4; Publisher: Altium Limited; PackageDescription: Axial Device, Thru-Hole; 2 Leads; 0.4 in Pin Spacing
3 6 7 9 C42 Ccomp1 Cin3 CinA1 CvccA1 = Cap: Capacitor; Published: 8-Jun-2000; LatestRevisionDate: 17-Jul-2002; LatestRevisionNote: Re-released for DXP Platform.; PackageReference: RAD-0.3; Publisher: Altium Limited; PackageDescription: Radial Cap, Thru-Hole; 2 Leads; 0.3 in Pin Spacing
*30 = INA214: Current monitor; Supplier 1: Digi-Key
BT1 = TPS61088: Boost converter
C41 = Cap Semi: Capacitor (Semiconductor SIM Model); Published: 8-Jun-2000; LatestRevisionDate: 29-May-2009; LatestRevisionNote: IPC-7351 Footprint Added.; PackageReference: C1206; Publisher: Altium Limited; PackageDescription: Chip Capacitor
LA1 = Inductor: Code_IEC: 1005; Published: 8-Jun-2000; LatestRevisionDate: 29-May-2009; LatestRevisionNote: IPC-7351 Footprint Added.; PackageReference: 0402-A; Publisher: Altium Limited; PackageDescription: Chip Inductor; Code_JEITA: 0402

## Sheet eps_bt2.SchDoc
size A4
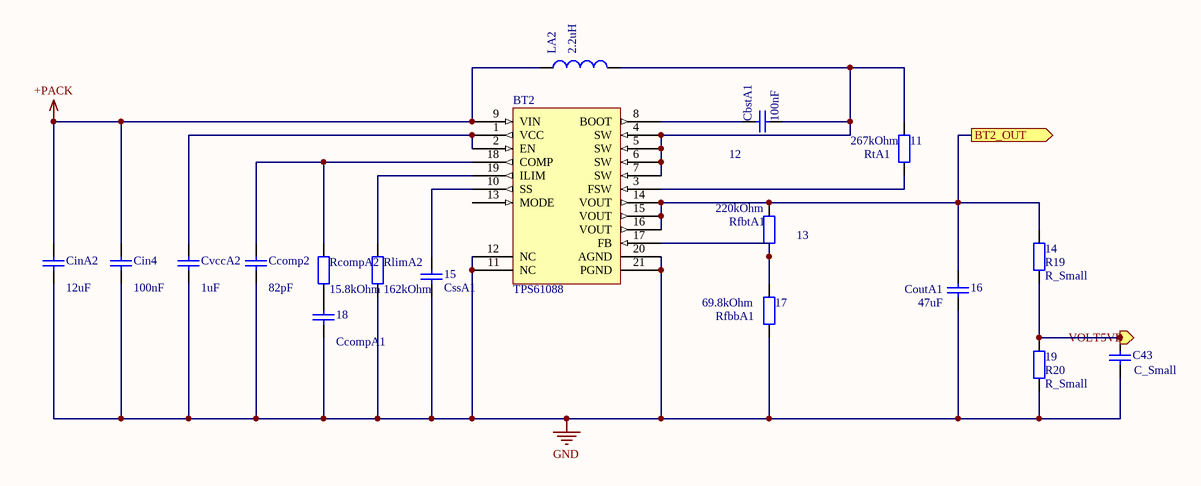
[diagram p8: eps_bt2.SchDoc]

### Parts
11  RtA1  value 267kOhm  [1608[0603]]
12  CbstA1  value 100nF  [1608[0603]]
13  RfbtA1  value 220kOhm  [1608[0603]]
14  R19  value R_Small  [1608[0603]]
15  CssA1  [1608[0603]]
16  CoutA1  value 47uF  [1608[0603]]
17  RfbbA1  value 69.8kOhm  [1608[0603]]
18  value CcompA1  [1608[0603]]
19  R20  value R_Small  [1608[0603]]
BT2  TPS61088  [QFN50P450X350X100-21N]
C43  value C_Small  [1608[0603]]
Ccomp2  value 82pF  [1608[0603]]
Cin4  value 100nF  [1608[0603]]
CinA2  value 12uF  [1608[0603]]
CvccA2  value 1uF  [1608[0603]]
LA2  value 2.2uH  [1608[0603]]
RcompA2  value 15.8kOhm  [1608[0603]]
RlimA2  value 162kOhm  [1608[0603]]

### Ports
BT2_OUT (out), VOLT5VB (out)

### Nets
+PACK: BT2.9(VIN) Cin4.2 CinA2.2 LA2.1
GND: 15.1 16.1 17.1 18.1 19.1 BT2.11(NC) BT2.12(NC) BT2.20(AGND) BT2.21(PGND) C43.2 Ccomp2.1 Cin4.1 CinA2.1 CvccA2.1 RlimA2.1
Net1_1: 13.2 14.2 16.2 BT2.14(VOUT) BT2.15(VOUT) BT2.16(VOUT) ; port BT2_OUT
Net5_1: 14.1 19.2 C43.1 ; port VOLT5VB
Net11_1: 11.1 12.1 BT2.4(SW) BT2.5(SW) BT2.6(SW) BT2.7(SW) LA2.2
Net11_2: 11.2 BT2.3(FSW)
Net12_2: 12.2 BT2.8(BOOT)
Net13_1: 13.1 17.2 BT2.17(FB)
Net15_2: 15.2 BT2.10(SS)
Net18_2: 18.2 RcompA2.1
NetBT2_1: BT2.1(VCC) BT2.2(EN) CvccA2.2
NetBT2_18: BT2.18(COMP) Ccomp2.2 RcompA2.2
NetBT2_19: BT2.19(ILIM) RlimA2.2

Not connected (* = marked no-connect by the designer): BT2 13(MODE)

### Library data of the parts
11 13 14 17 19 RcompA2 RlimA2 = Res2: Resistor; Published: 8-Jun-2000; LatestRevisionDate: 17-Jul-2002; LatestRevisionNote: Re-released for DXP Platform.; PackageReference: AXIAL-0.4; Publisher: Altium Limited; PackageDescription: Axial Device, Thru-Hole; 2 Leads; 0.4 in Pin Spacing
12 15 16 18 C43 Ccomp2 Cin4 CinA2 CvccA2 = Cap: Capacitor; Published: 8-Jun-2000; LatestRevisionDate: 17-Jul-2002; LatestRevisionNote: Re-released for DXP Platform.; PackageReference: RAD-0.3; Publisher: Altium Limited; PackageDescription: Radial Cap, Thru-Hole; 2 Leads; 0.3 in Pin Spacing
BT2 = TPS61088: Boost converter
LA2 = Inductor: Code_IEC: 1005; Published: 8-Jun-2000; LatestRevisionDate: 29-May-2009; LatestRevisionNote: IPC-7351 Footprint Added.; PackageReference: 0402-A; Publisher: Altium Limited; PackageDescription: Chip Inductor; Code_JEITA: 0402

## Sheet eps_batt.SchDoc
size A4
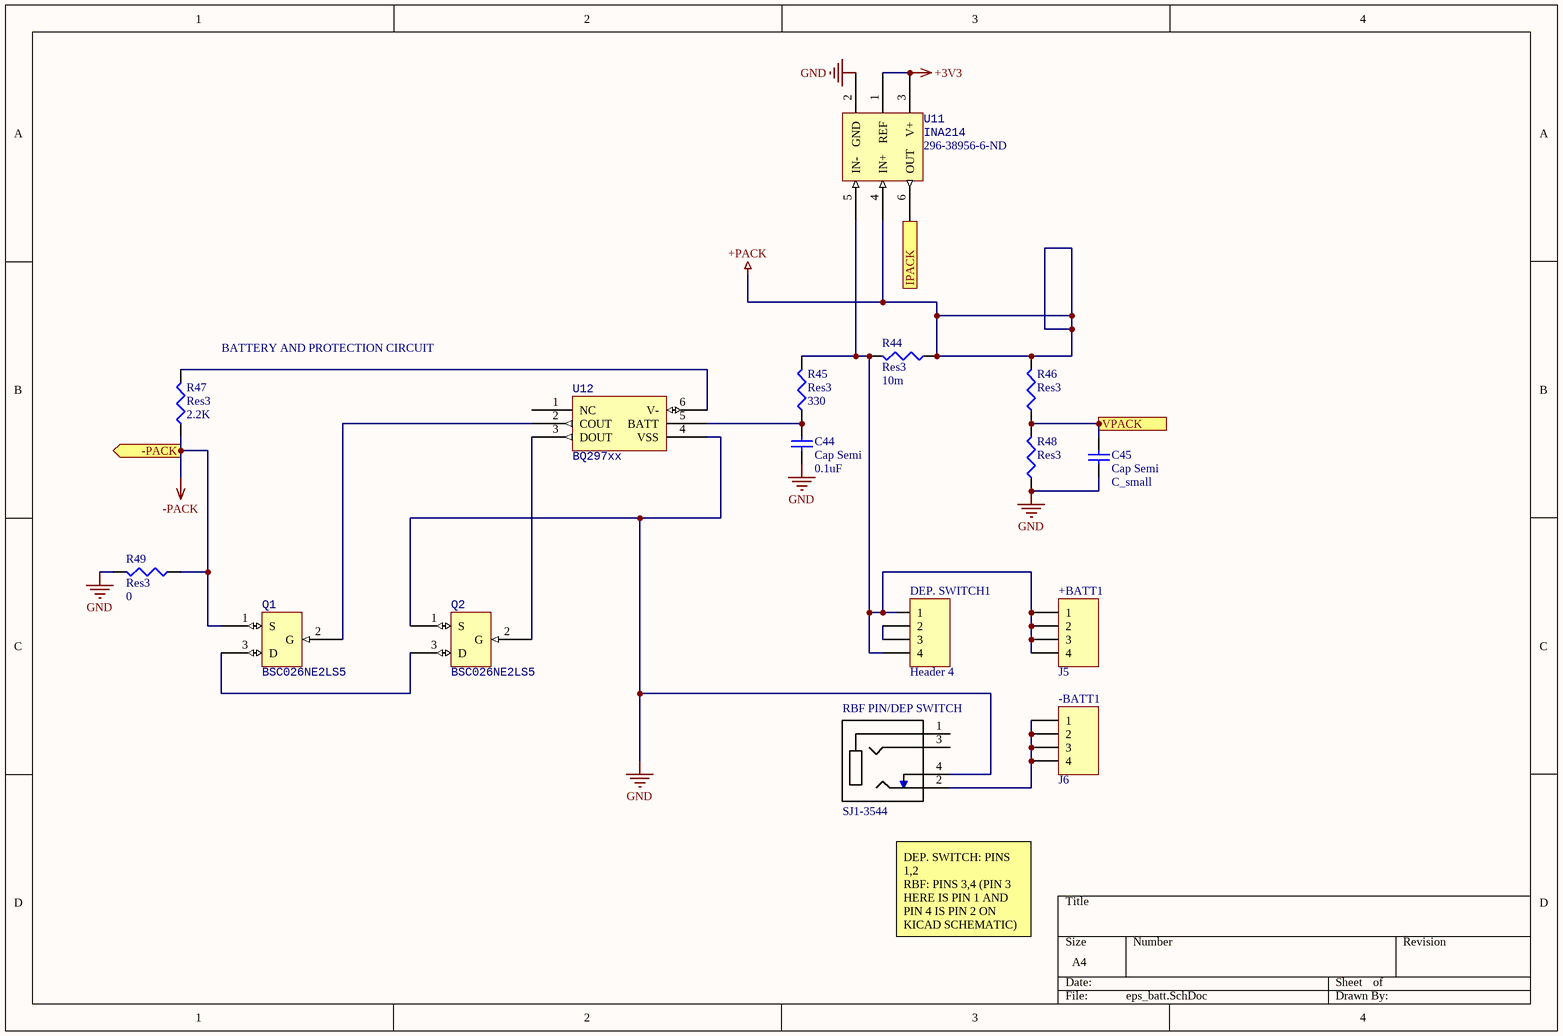
[diagram p9: eps_batt.SchDoc]

### Parts
+BATT1  J5  [DF14-4P-1.25H(55)]
-BATT1  J6  [DF14-4P-1.25H(55)]
C44  Cap Semi  value 0.1uF  [1608[0603]]
C45  Cap Semi  value C_small  [1608[0603]]
DEP._SWITCH1  Header 4  [DF14-4P-1.25H(55)]
Q1  BSC026NE2LS5  [INF-PG-TDSON-8-1_V]
Q2  BSC026NE2LS5  [INF-PG-TDSON-8-1_V]
R44  Res3  value 10m  [J1-0603]
R45  Res3  value 330  [J1-0603]
R46  Res3  [J1-0603]
R47  Res3  value 2.2K  [J1-0603]
R48  Res3  [J1-0603]
R49  Res3  value 0  [J1-0603]
RBF_PIN/DEP_SWITCH  SJ1-3544  [CUI_SJ1-3544]
U11  INA214  Supplier Part Number 1: 296-38956-6-ND  [SOT65P210X110-6N]
U12  BQ297xx  [SON50P150X150X80-6N - duplicate1]

### Ports
-PACK (out), IPACK (out), VPACK (in)

### Nets
+3V3: U11.1(REF) U11.3(V+)
+PACK: R44.1 R46.2 U11.4(IN+)
-PACK: Q1.1(S) R47.1 R49.1 ; port -PACK
GND: C44.1 C45.1 Q2.1(S) R48.1 R49.2 RBF_PIN/DEP_SWITCH.4 U11.2(GND) U12.4(VSS)
Net+BATT1_1: +BATT1.1 +BATT1.2 +BATT1.3 +BATT1.4 DEP._SWITCH1.1 DEP._SWITCH1.4 R44.2 R45.2 U11.5(IN-)
Net-BATT1_1: -BATT1.1 -BATT1.2 -BATT1.3 -BATT1.4 RBF_PIN/DEP_SWITCH.2
NetC44_2: C44.2 R45.1 U12.5(BATT)
NetC45_2: C45.2 R46.1 R48.2 ; port VPACK
NetDEP._SWITCH1_2: DEP._SWITCH1.2 DEP._SWITCH1.3
NetQ1_2: Q1.2(G) U12.2(COUT)
NetQ1_3: Q1.3(D) Q2.3(D)
NetQ2_2: Q2.2(G) U12.3(DOUT)
NetR47_2: R47.2 U12.6(V-)
NetU11_6: U11.6(OUT) ; port IPACK

Not connected (* = marked no-connect by the designer): RBF_PIN/DEP_SWITCH 1 3; U12 1(NC)

### Notes on the sheet
- (near R47) BATTERY AND PROTECTION CIRCUIT
- DEP. SWITCH: PINS 1,2
  RBF: PINS 3,4 (PIN 3 HERE IS PIN 1 AND PIN 4 IS PIN 2 ON KICAD SCHEMATIC)

### Library data of the parts
+BATT1 -BATT1 DEP._SWITCH1 = Header 4: Header, 4-Pin; LatestRevisionDate: 17-Jul-2002; LatestRevisionNote: Re-released for DXP Platform.; Publisher: Altium Limited; ComponentLink1Description: Hirose DF14-4P-1.25H(55) Right Angle; ComponentLink1URL: https://www.digikey.ca/product-detail/en/hirose-electric-co-ltd/DF14-4P-1.25H-55/H10317-ND/964472
C44 C45 = Cap Semi: Capacitor (Semiconductor SIM Model); Published: 8-Jun-2000; LatestRevisionDate: 29-May-2009; LatestRevisionNote: IPC-7351 Footprint Added.; PackageReference: C1206; Publisher: Altium Limited; PackageDescription: Chip Capacitor
Q1 Q2 = BSC026NE2LS5: MOSFET; ComponentLink1Description: N-Channel Mosfet; ComponentLink1URL: https://www.digikey.ca/product-detail/en/infineon-technologies/BSC026NE2LS5ATMA1/BSC026NE2LS5ATMA1DKR-ND/6564538
R44-R49 = Res3: Resistor; Published: 8-Jun-2000; LatestRevisionDate: 29-May-2009; LatestRevisionNote: IPC-7351 Footprint Added.; PackageReference: J1-0603; Publisher: Altium Limited; PackageDescription: Chip Resistor
U11 = INA214: Current monitor; Supplier 1: Digi-Key; ComponentLink1Description: IC Current Monitor; ComponentLink1URL: https://www.digikey.ca/product-detail/en/texas-instruments/INA214AIDCKR/296-38956-1-ND/5143051
U12 = BQ2972: Battery protection; ComponentLink1Description: Charge Controller; ComponentLink1URL: https://www.digikey.com/product-detail/en/texas-instruments/BQ29729DSET/296-44131-1-ND/6005144
RBF_PIN/DEP_SWITCH = SJ1-3544: Value: *

## Nets that join several sheets
+3V3: eps_32m1 (13 pins), eps_can_transceiver (C36.2 C37.2 U8.3), eps_pex (C22.2 R10.1 U3.9), eps_bb1 (6 pins), eps_bb2 (6 pins), eps_bt1 (*30.1 *30.3 C41.2), eps_batt (U11.1 U11.3)
+PACK: eps_bb1 (6 pins), eps_bb2 (6 pins), eps_bt1 (BT1.9 Cin3.2 CinA1.2 LA1.1), eps_bt2 (BT2.9 Cin4.2 CinA2.2 LA2.1), eps_batt (R44.1 R46.2 U11.4)
GND: eps_32m1 (12 pins), eps_can_transceiver (6 pins), eps_pex (5 pins), eps_bb1 (11 pins), eps_bb2 (11 pins), eps_bt1 (17 pins), eps_bt2 (15 pins), eps_batt (8 pins)
Net1_1: eps_bt1 (8 pins), eps_bt2 (6 pins)
Net5_1: eps_bt1 (5.1 10.2 C42.1), eps_bt2 (14.1 19.2 C43.1)
NetC28_2: eps_bb1 (C28.2 R21.2 R22.1), eps_bb2 (C?.1 R?#1.2 R?#2.1)
NetR10_2: eps_32m1 (U4.32), eps_pex (R10.2 U3.18)
NetR25_2: eps_digital (R25.2), eps_32m1 (U4.18)
NetR26_2: eps_digital (R26.2), eps_32m1 (U4.22)
NetR34_2: eps_32m1 (U4.7 U5.9), eps_can_transceiver (R34.2)
NetR36_2: eps_32m1 (U4.6 U5.5), eps_can_transceiver (R36.2)
NetR37_2: eps_32m1 (U4.30), eps_can_transceiver (R37.2)
NetU3_11: eps_32m1 (U4.3), eps_pex (U3.11)
NetU3_12: eps_32m1 (U4.28), eps_pex (U3.12)
NetU3_13: eps_32m1 (U4.9), eps_pex (U3.13)
NetU3_14: eps_32m1 (U4.8), eps_pex (U3.14)